# Altium project PCB_Project.PrjPcb
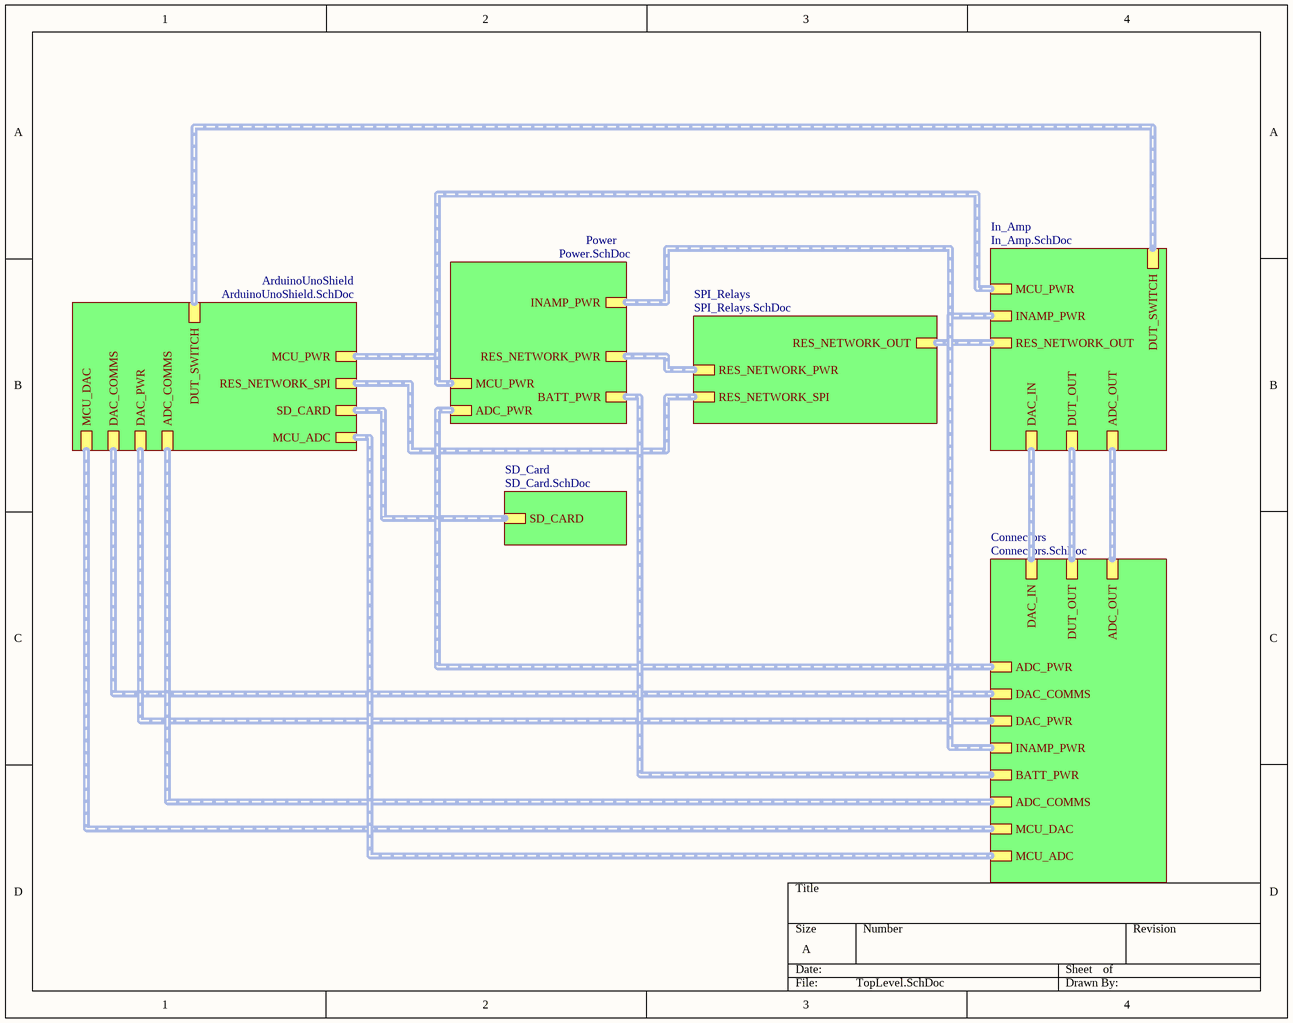
[diagram p0: TopLevel.SchDoc]
7 sheets, 123 parts. Net scope: hierarchical (ports join the sheet entries above them; power ports are global).
Board files: 6C-2L-1550um.PcbDoc, ArduinoUnoShield.PcbDoc
Sheets:
  TopLevel.SchDoc
    ArduinoUnoShield = ArduinoUnoShield.SchDoc
    Power = Power.SchDoc
    SD_Card = SD_Card.SchDoc
    In_Amp = In_Amp.SchDoc
    Connectors = Connectors.SchDoc
    SPI_Relays = SPI_Relays.SchDoc

## Sheet TopLevel.SchDoc
size A

### Sub-sheets
ArduinoUnoShield = ArduinoUnoShield.SchDoc: SD_CARD (harness SD_CARD), RES_NETWORK_SPI (harness RES_NETWORK_SPI), MCU_PWR (harness MCU_PWR), MCU_DAC (harness MCU_DAC), DAC_COMMS (harness DAC_COMMS), DAC_PWR (harness DAC_PWR), ADC_COMMS (harness ADC_COMMS), DUT_SWITCH (harness DUT_SWITCH), MCU_ADC (harness MCU_ADC)
Connectors = Connectors.SchDoc: DAC_IN (harness DAC_IN), DUT_OUT (harness DUT_OUT), ADC_OUT (harness ADC_OUT), ADC_PWR (harness ADC_PWR), DAC_COMMS (harness DAC_COMMS), DAC_PWR (harness DAC_PWR), INAMP_PWR (harness INAMP_PWR), BATT_PWR (harness BATT_PWR), ADC_COMMS (harness ADC_COMMS), MCU_DAC (harness MCU_DAC), MCU_ADC (harness MCU_ADC)
In_Amp = In_Amp.SchDoc: RES_NETWORK_OUT (harness RES_NETWORK_OUT), DAC_IN (harness DAC_IN), DUT_OUT (harness DUT_OUT), ADC_OUT (harness ADC_OUT), INAMP_PWR (harness INAMP_PWR), MCU_PWR (harness MCU_PWR), DUT_SWITCH (harness DUT_SWITCH)
Power = Power.SchDoc: RES_NETWORK_PWR (harness RES_NETWORK_PWR), MCU_PWR (harness MCU_PWR), ADC_PWR (harness ADC_PWR), INAMP_PWR (harness INAMP_PWR), BATT_PWR (harness BATT_PWR)
SD_Card = SD_Card.SchDoc: SD_CARD (harness SD_CARD)
SPI_Relays = SPI_Relays.SchDoc: RES_NETWORK_OUT (harness RES_NETWORK_OUT), RES_NETWORK_PWR (harness RES_NETWORK_PWR), RES_NETWORK_SPI (harness RES_NETWORK_SPI)

### Buses and harness runs
harness sheet ArduinoUnoShield/ADC_COMMS = sheet Connectors/ADC_COMMS
harness sheet ArduinoUnoShield/DAC_COMMS = sheet Connectors/DAC_COMMS
harness sheet ArduinoUnoShield/DAC_PWR = sheet Connectors/DAC_PWR
harness sheet ArduinoUnoShield/DUT_SWITCH = sheet In_Amp/DUT_SWITCH
harness sheet ArduinoUnoShield/MCU_ADC = sheet Connectors/MCU_ADC
harness sheet ArduinoUnoShield/MCU_DAC = sheet Connectors/MCU_DAC
harness sheet ArduinoUnoShield/MCU_PWR = sheet In_Amp/MCU_PWR = sheet Power/MCU_PWR
harness sheet ArduinoUnoShield/RES_NETWORK_SPI = sheet SPI_Relays/RES_NETWORK_SPI
harness sheet ArduinoUnoShield/SD_CARD = sheet SD_Card/SD_CARD
harness sheet Connectors/ADC_OUT = sheet In_Amp/ADC_OUT
harness sheet Connectors/ADC_PWR = sheet Power/ADC_PWR
harness sheet Connectors/BATT_PWR = sheet Power/BATT_PWR
harness sheet Connectors/DAC_IN = sheet In_Amp/DAC_IN
harness sheet Connectors/DUT_OUT = sheet In_Amp/DUT_OUT
harness sheet Connectors/INAMP_PWR = sheet In_Amp/INAMP_PWR = sheet Power/INAMP_PWR
harness sheet In_Amp/RES_NETWORK_OUT = sheet SPI_Relays/RES_NETWORK_OUT
harness sheet Power/RES_NETWORK_PWR = sheet SPI_Relays/RES_NETWORK_PWR

## Sheet ArduinoUnoShield.SchDoc
size A4
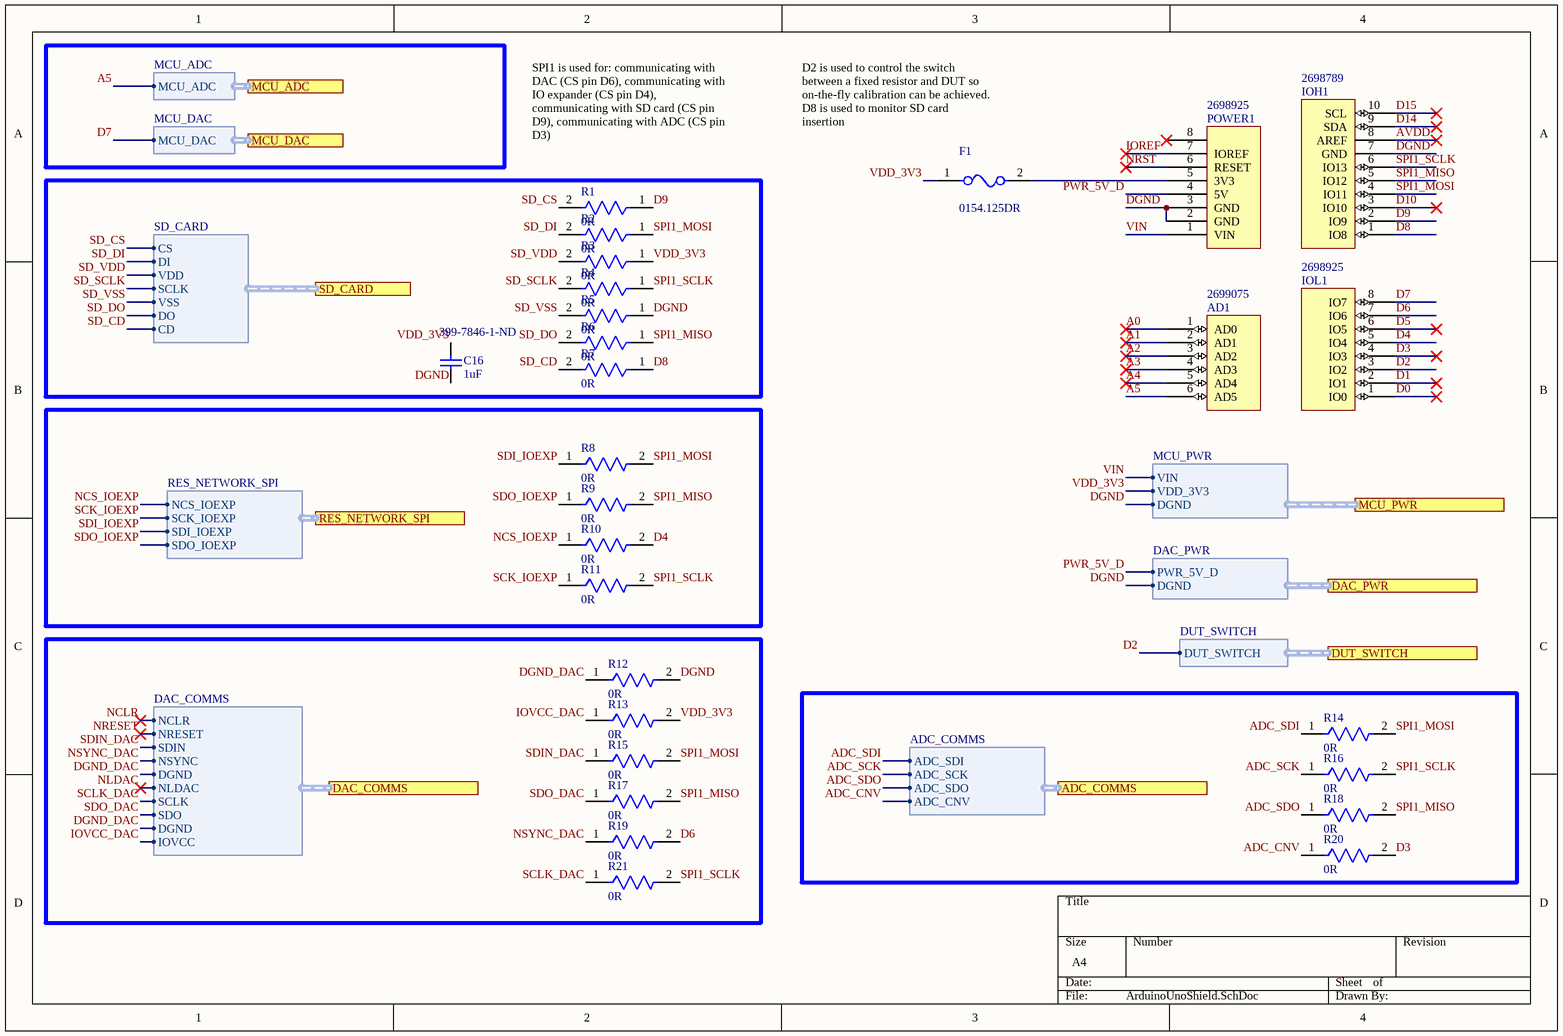
[diagram p1: ArduinoUnoShield.SchDoc]

### Parts
AD1  Supplier Part Number 4: 2699075  [Header 6x1 8.5mm]  (hidden comment: AD)
C16  1uF  Supplier Part Number 1: 399-7846-1-ND  [CAPC1608X95X35LL15T15]
F1  0154.125DR  [FP-0154-MFG]
IOH1  Supplier Part Number 3: 2698789  [Header 10x1 8.5mm]  (hidden comment: IOH)
IOL1  Supplier Part Number 4: 2698925  [Header 8x1 8.5mm]  (hidden comment: IOL)
POWER1  Supplier Part Number 4: 2698925  [Header 8x1 8.5mm]  (hidden comment: POWER_UNO)
R1  0R  [FP-CR0603-MFG]
R2  0R  [FP-CR0603-MFG]
R3  0R  [FP-CR0603-MFG]
R4  0R  [FP-CR0603-MFG]
R5  0R  [FP-CR0603-MFG]
R6  0R  [FP-CR0603-MFG]
R7  0R  [FP-CR0603-MFG]
R8  0R  [FP-CR0603-MFG]
R9  0R  [FP-CR0603-MFG]
R10  0R  [FP-CR0603-MFG]
R11  0R  [FP-CR0603-MFG]
R12  0R  [FP-CR0603-MFG]
R13  0R  [FP-CR0603-MFG]
R14  0R  [FP-CR0603-MFG]
R15  0R  [FP-CR0603-MFG]
R16  0R  [FP-CR0603-MFG]
R17  0R  [FP-CR0603-MFG]
R18  0R  [FP-CR0603-MFG]
R19  0R  [FP-CR0603-MFG]
R20  0R  [FP-CR0603-MFG]
R21  0R  [FP-CR0603-MFG]

### Ports
ADC_COMMS (harness ADC_COMMS), DAC_COMMS (harness DAC_COMMS), DAC_PWR (harness DAC_PWR), DUT_SWITCH (harness DUT_SWITCH), MCU_ADC (harness MCU_ADC), MCU_DAC (harness MCU_DAC), MCU_PWR (harness MCU_PWR), RES_NETWORK_SPI (harness RES_NETWORK_SPI), SD_CARD (harness SD_CARD)

### Harnesses
SD_CARD: CS, DI, VDD, SCLK, VSS, DO, CD
MCU_PWR: VDD_3V3, DGND, VIN
DAC_COMMS: NCLR, NRESET, SDIN, DGND, NSYNC, NLDAC, SDO, SCLK, DGND, IOVCC
RES_NETWORK_SPI: NCS_IOEXP, SCK_IOEXP, SDI_IOEXP, SDO_IOEXP
MCU_DAC: MCU_DAC
MCU_ADC: MCU_ADC
DAC_PWR: DGND, PWR_5V_D
ADC_COMMS: ADC_SCK, ADC_SDO, ADC_SDI, ADC_CNV
DUT_SWITCH: DUT_SWITCH

### Nets
A0: AD1.1(AD0)
A1: AD1.2(AD1)
A2: AD1.3(AD2)
A3: AD1.4(AD3)
A4: AD1.5(AD4)
A5: AD1.6(AD5) ; port MCU_ADC.MCU_ADC
ADC_CNV: R20.1 ; port ADC_COMMS.ADC_CNV
ADC_SCK: R16.1 ; port ADC_COMMS.ADC_SCK
ADC_SDI: R14.1 ; port ADC_COMMS.ADC_SDI
ADC_SDO: R18.1 ; port ADC_COMMS.ADC_SDO
AVDD: IOH1.8(AREF)
D0: IOL1.1(IO0)
D1: IOL1.2(IO1)
D2: IOL1.3(IO2) ; port DUT_SWITCH.DUT_SWITCH
D3: IOL1.4(IO3) R20.2
D4: IOL1.5(IO4) R10.2
D5: IOL1.6(IO5)
D6: IOL1.7(IO6) R19.2
D7: IOL1.8(IO7) ; port MCU_DAC.MCU_DAC
D8: IOH1.1(IO8) R7.1
D9: IOH1.2(IO9) R1.1
D10: IOH1.3(IO10)
D14: IOH1.9(SDA)
D15: IOH1.10(SCL)
DGND: C16.1 IOH1.7(GND) POWER1.2(GND) POWER1.3(GND) R5.1 R12.1 R12.2 ; port MCU_PWR.DGND, port DAC_COMMS.DGND, port DAC_PWR.DGND  [also labelled DGND_DAC]
IOREF: POWER1.7(IOREF)
IOVCC_DAC: R13.1 ; port DAC_COMMS.IOVCC  [project net IOVCC]
NCS_IOEXP: R10.1 ; port RES_NETWORK_SPI.NCS_IOEXP
NRST: POWER1.6(RESET)
NSYNC_DAC: R19.1 ; port DAC_COMMS.NSYNC  [project net NSYNC]
PWR_5V_D: POWER1.4(5V) ; port DAC_PWR.PWR_5V_D
SCK_IOEXP: R11.1 ; port RES_NETWORK_SPI.SCK_IOEXP
SCLK_DAC: R21.1 ; port DAC_COMMS.SCLK  [project net SCLK]
SD_CD: R7.2 ; port SD_CARD.CD
SD_CS: R1.2 ; port SD_CARD.CS
SD_DI: R2.2 ; port SD_CARD.DI
SD_DO: R6.2 ; port SD_CARD.DO
SD_SCLK: R4.2 ; port SD_CARD.SCLK
SD_VDD: R3.2 ; port SD_CARD.VDD
SD_VSS: R5.2 ; port SD_CARD.VSS
SDI_IOEXP: R8.1 ; port RES_NETWORK_SPI.SDI_IOEXP
SDIN_DAC: R15.1 ; port DAC_COMMS.SDIN  [project net SDIN]
SDO_DAC: R17.1 ; port DAC_COMMS.SDO  [project net SDO]
SDO_IOEXP: R9.1 ; port RES_NETWORK_SPI.SDO_IOEXP
SPI1_MISO: IOH1.5(IO12) R6.1 R9.2 R17.2 R18.2
SPI1_MOSI: IOH1.4(IO11) R2.1 R8.2 R14.2 R15.2
SPI1_SCLK: IOH1.6(IO13) R4.1 R11.2 R16.2 R21.2
VDD_3V3: C16.2 F1.1 R3.1 R13.2 ; port MCU_PWR.VDD_3V3
VIN: POWER1.1(VIN) ; port MCU_PWR.VIN  [project net PWR_VBAT]
NetF1_2: F1.2 POWER1.5(3V3)

Not connected (* = marked no-connect by the designer): POWER1 8*

### Notes on the sheet
- SPI1 is used for: communicating with DAC (CS pin D6), communicating with IO expander (CS pin D4), communicating with SD card (CS pin D9), communicating with ADC (CS pin D3)
- (near F1) D2 is used to control the switch between a fixed resistor and DUT so on-the-fly calibration can be achieved. D8 is used to monitor SD card insertion

### Library data of the parts
C16 = CMP-2006-02216-1: Manufacturer: Kemet; Part Number: C0603C105K3PACTU; Description: KEMET - C0603C105K3PACTU - SMD Multilayer Ceramic Capacitor, 1 µF, 25 V, 0603 [1608 Metric], ± 10%, X5R, C Series KEMET; Dielectric Material: Ceramic; Tolerance: 10%; Dielectric: X5R; Voltage Rating (DC): 25V; Supplier 1: Digi-Key; Manufacturer Part Number: C0603C105K3PACTU; RoHS: Yes; Category: Ceramic Capacitors; Stock 1: 157618; Pricing 1: 1=0.18000, 10=0.12700, 50=0.07220, 100=0.05980, 500=0.04194, 1000=0.03472 (USD); Mount: Surface Mount; Case/Package: 0603; Contact Plating: Tin,Matte; Min Operating Temperature: -55°C; Max Operating Temperature: 85°C; Capacitance: 1uF; Packaging: Tape and Reel; Voltage: 25V; Termination: SMD/SMT; Length: 1.6mm; Height: 0.8mm; Depth: 0.8mm; Radiation Hardening: No; Lead Free: Lead Free; ComponentLink1URL: https://datasheet.ciiva.com/28610/1918694-28610792.pdf?src-supplier=Element14; ComponentLink1Description: https://datasheet.ciiva.com/28610/1918694-28610792.pdf?src-supplier=Element14; ComponentLink2URL: https://datasheet.ciiva.com/5998/40889-5998745.pdf?src-supplier=Farnell; ComponentLink2Description: https://datasheet.ciiva.com/5998/40889-5998745.pdf?src-supplier=Farnell; Supplier Unit Price 1: 0.18
F1 = CMP-08604-000003-1: FUSE BOARD MNT 125MA 125VAC/VDC; Manufacturer: Littelfuse Inc; Voltage Rating Dc: 125V; Conn Orientation: Horizontal; Number Of Fuses: 1; Fuse Current: 0.125A; Automotive: No; Device Class L1: Circuit Protection; Temperature Range High: +125°C; Category: Fuse; Temperature: -55°C to +125°C; Lead Free: Yes; ComponentLink2Description: Datasheet; RoHS: TRUE; Mouser Description: Fuse Chip Very Fast Acting 0.125A SMD Solder Pad 9.73 X 5.03 X 3.81mm T/R CSA/PSE/UL; Octopart: https://octopart.com/0154.125dr-littelfuse-557957; Height: 3.81mm; Digikey Description: FUSE BOARD MNT 125MA 125VAC/VDC; Temperature Range Low: -55°C; Voltage Rating Ac: 125V; Device Class L3: unset; Package: 0154; Device Class L2: Fuse Holders; Manufacturer Part Number: 0154.125DR; ComponentLink2URL: https://www.littelfuse.com/~/media/electronics/datasheets/fuses/littelfuse_fuse_154_154t_154l_154tl_datasheet.pdf.pdf
R1-R21 = CMP-07231-000023-1: Thick Film Chip Resistors 0603 0Ω 0.1W 5%; Power Rating: 100mW; Resistance: 0mR; Voltage Rating (DC): 50V; Tolerance: 1%; Temperature Coefficient: 500ppm/°C; Depth: 0.8mm; Height: 0.45mm; Case Code (Metric): 1608; Number of Pins: 2; Max Operating Temperature: 155°C; Mount: Surface Mount; REACH SVHC: No SVHC; Radiation Hardening: No; Width: 0.8mm; Max Power Dissipation: 100mW; Thickness: 457um; Package Quantity: 5000; Composition: Thick Film; Case/Package: 0603; Military Standard: Not; Packaging: Tape and Reel; Voltage Rating: 50V; Case Code (Imperial): 0603; Min Operating Temperature: -55°C; Contact Plating: Tin; Length: 1.6mm; Termination: SMD/SMT
AD1 = AD: Supplier 1: Arrow; Supplier Part Number 1: 2699089; Supplier 2: Digi-Key; Supplier Part Number 2: SAM1198-06-ND; Supplier 3: Arrow; Supplier Part Number 3: 2699088; Supplier 4: Arrow
IOH1 = IOH: Supplier 1: Arrow; Supplier Part Number 1: 2698803S4475693N1004; Supplier 2: Digi-Key; Supplier Part Number 2: SAM1198-10-ND; Supplier 3: Arrow
IOL1 = IOL: Supplier 1: Digi-Key; Supplier Part Number 1: SAM1198-08-ND; Supplier 2: Arrow; Supplier Part Number 2: 2698939; Supplier 3: Arrow; Supplier Part Number 3: 2698940; Supplier 4: Arrow
POWER1 = POWER_UNO: Supplier 1: Digi-Key; Supplier Part Number 1: SAM1198-08-ND; Supplier 2: Arrow; Supplier Part Number 2: 2698939; Supplier 3: Arrow; Supplier Part Number 3: 2698940; Supplier 4: Arrow

## Sheet Power.SchDoc
size A
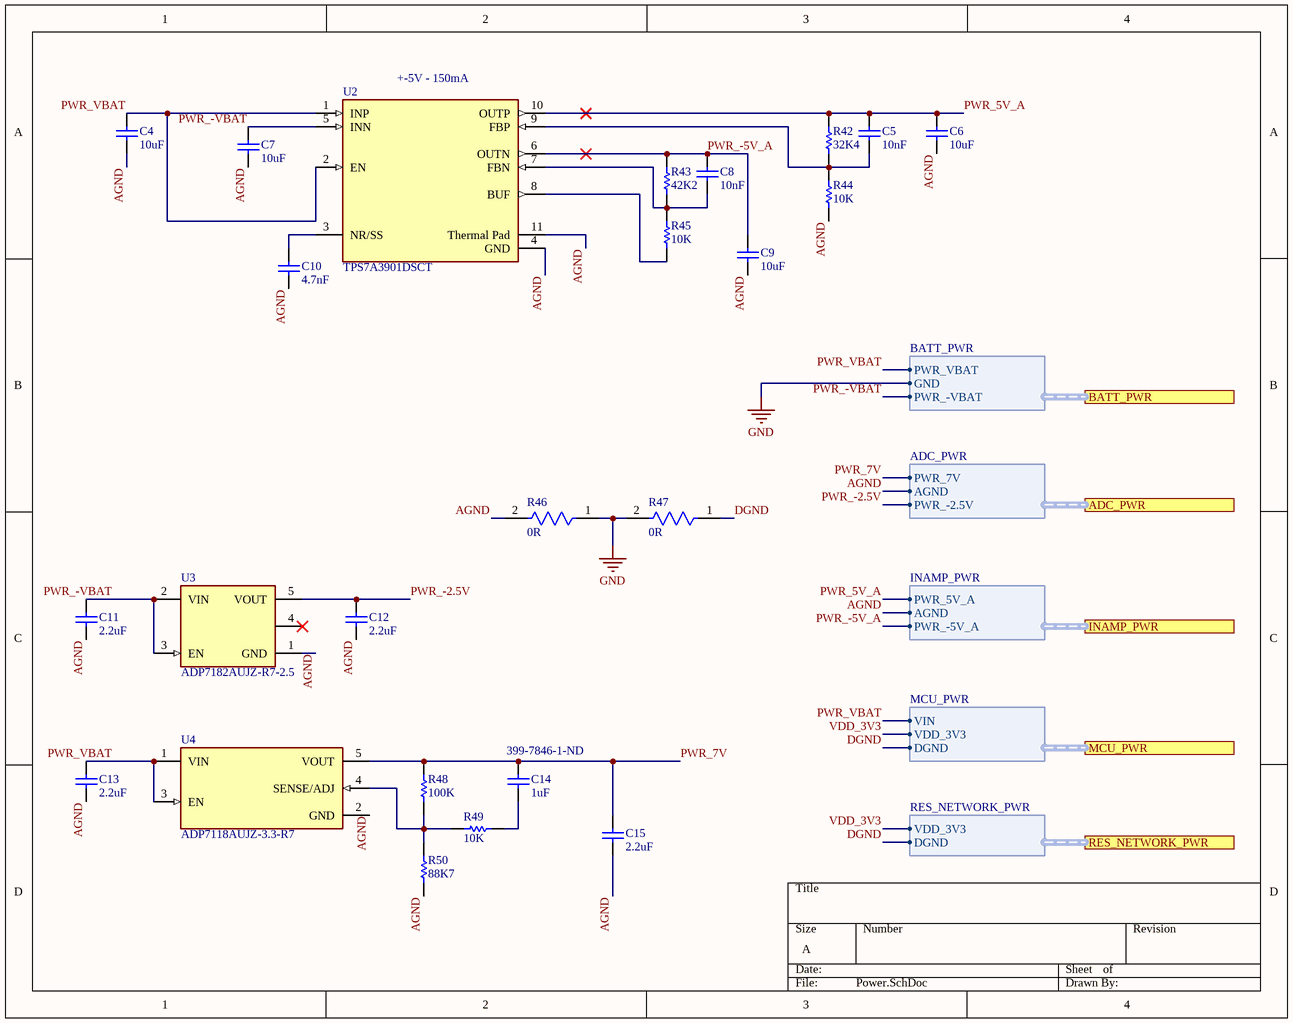
[diagram p2: Power.SchDoc]

### Parts
C4  10uF  [CAPC2013X135X45ML10T25]
C5  10nF  [CAPC1608X90X35LL15T15]
C6  10uF  [CAPC2013X135X45ML10T25]
C7  10uF  [CAPC2013X135X45ML10T25]
C8  10nF  [CAPC1608X90X35LL15T15]
C9  10uF  [CAPC2013X135X45ML10T25]
C10  4.7nF  [CAPC1608X90X35LL15T15]
C11  2.2uF  [CAPC1608X90X35ML10T15]
C12  2.2uF  [CAPC1608X90X35ML10T15]
C13  2.2uF  [CAPC1608X90X35ML10T15]
C14  1uF  Supplier Part Number 1: 399-7846-1-ND  [CAPC1608X95X35LL15T15]
C15  2.2uF  [CAPC1608X90X35ML10T15]
R42  32K4  [RESC1608X55X25ML10T15]
R43  42K2  [RESC0805(2012)_N]
R44  10K  [RESC1609X50X30NL8T20]
R45  10K  [RESC1609X50X30NL8T20]
R46  0R  [FP-CR0603-MFG]
R47  0R  [FP-CR0603-MFG]
R48  100K  [RESC1608X55X25ML10T15]
R49  10K  [RESC1609X50X30NL8T20]
R50  88K7  [RESC1608X55X25ML10T15]
U2  TPS7A3901DSCT  [TPS7A3901DSCT]
U3  ADP7182AUJZ-R7-2.5  [FP-UJ-5-IPC_A]
U4  ADP7118AUJZ-3.3-R7  [FP-UJ-5-IPC_C]

### Ports
ADC_PWR (harness ADC_PWR), BATT_PWR (harness BATT_PWR), INAMP_PWR (harness INAMP_PWR), MCU_PWR (harness MCU_PWR), RES_NETWORK_PWR (harness RES_NETWORK_PWR)

### Harnesses
RES_NETWORK_PWR: VDD_3V3, DGND
MCU_PWR: VDD_3V3, DGND, VIN
INAMP_PWR: AGND, PWR_-5V_A, PWR_5V_A
ADC_PWR: AGND, PWR_-2.5V, PWR_7V
BATT_PWR: GND, PWR_-VBAT, PWR_VBAT

### Nets
GND: R46.1 R47.2 ; port BATT_PWR.GND
AGND: C4.1 C6.1 C7.1 C9.1 C10.1 C11.1 C12.1 C13.1 C15.1 R44.1 R46.2 R50.1 U2.4(GND) U2.11(Thermal_Pad) U3.1(GND) U4.2(GND) ; port INAMP_PWR.AGND, port ADC_PWR.AGND
DGND: R47.1 ; port RES_NETWORK_PWR.DGND, port MCU_PWR.DGND
PWR_5V_A: C5.2 C6.2 R42.1 U2.10(OUTP) ; port INAMP_PWR.PWR_5V_A
PWR_7V: C14.2 C15.2 R48.2 U4.5(VOUT) ; port ADC_PWR.PWR_7V
PWR_-2.5V: C12.2 U3.5(VOUT) ; port ADC_PWR.PWR_-2.5V
PWR_-5V_A: C8.2 C9.2 R43.2 U2.6(OUTN) ; port INAMP_PWR.PWR_-5V_A
PWR_-VBAT: C7.2 C11.2 U2.5(INN) U3.2(VIN) U3.3(EN) ; port BATT_PWR.PWR_-VBAT
PWR_VBAT: C4.2 C13.2 U2.1(INP) U2.2(EN) U4.1(VIN) U4.3(EN) ; port MCU_PWR.VIN, port BATT_PWR.PWR_VBAT
VDD_3V3: port RES_NETWORK_PWR.VDD_3V3, port MCU_PWR.VDD_3V3
NetC5_1: C5.1 R42.2 R44.2 U2.9(FBP)
NetC8_1: C8.1 R43.1 R45.2 U2.7(FBN)
NetC10_2: C10.2 U2.3(NR/SS)
NetC14_1: C14.1 R49.2
NetR45_1: R45.1 U2.8(BUF)
NetR48_1: R48.1 R49.1 R50.2 U4.4(SENSE/ADJ)

Not connected (* = marked no-connect by the designer): U3 4(ADJ)*

### Notes on the sheet
- (near U2) +-5V - 150mA

### Library data of the parts
C4 C6 C7 C9 = CMP-2007-03541-1: Part Number: GRM21BR61E106KA73L; Manufacturer: Murata
C5 C8 = CMP-2006-04374-1: Manufacturer: AVX Interconnect / Elco; Part Number: 06035C-103KAT2A
C10 = CMP-2006-04439-1: Part Number: 06035C472KAT2A; Manufacturer: AVX Interconnect / Elco
C11-C13 C15 = CMP-2006-02820-1: Part Number: GRM188R61E225KA12D; Manufacturer: Murata
C14 = CMP-2006-02216-1: as C16 on sheet ArduinoUnoShield; Supplier 1: Digi-Key; Manufacturer Part Number: C0603C105K3PACTU; RoHS: Yes; Category: Ceramic Capacitors; Stock 1: 157618; Pricing 1: 1=0.18000, 10=0.12700, 50=0.07220, 100=0.05980, 500=0.04194, 1000=0.03472 (USD); Mount: Surface Mount; Case/Package: 0603; Contact Plating: Tin,Matte; Min Operating Temperature: -55°C; Max Operating Temperature: 85°C; Capacitance: 1uF; Packaging: Tape and Reel; Voltage: 25V; Termination: SMD/SMT; Length: 1.6mm; Height: 0.8mm; Depth: 0.8mm; Radiation Hardening: No; Lead Free: Lead Free; ComponentLink1URL: https://datasheet.ciiva.com/28610/1918694-28610792.pdf?src-supplier=Element14; ComponentLink1Description: https://datasheet.ciiva.com/28610/1918694-28610792.pdf?src-supplier=Element14; ComponentLink2URL: https://datasheet.ciiva.com/5998/40889-5998745.pdf?src-supplier=Farnell; ComponentLink2Description: https://datasheet.ciiva.com/5998/40889-5998745.pdf?src-supplier=Farnell; Supplier Unit Price 1: 0.18
R42 = CMP-2000-04011-1: Manufacturer: Yageo; Part Number: RC0603FR-0732K4L
R43 = CMP-1013-00693-1: 42K2 0.125W 1% 0805 (2012 Metric)  SMD; Case-EIA: 0805; Value: 42200.00 Ohm; Case-Metric: 2012; Power: 0.125 W; Tolerance: 1 %; Technology: SMT
R44 R45 R49 = CMP-1666-00005-4: Chip Resistor, 10 KOhm, +/- 1%, 100 mW, -55 to 155 degC, 0603 (1608 Metric), RoHS, Tape and Reel; Manufacturer: Vishay Semiconductor; Voltage Rating: 75 V; Max Operating Temperature: 155 degC; PackageDescription: 2-Pin Surface Mount Device, Body 1.575 x 0.85 mm; ComponentLink1Description: Manufacturer URL; RoHSCompliant: true; PackageReference: 0603; REACH SVHC: Unknown; Length: 1.55 mm; DatasheetVersion: 06/2012; Packaging: Tape and Reel; Min Operating Temperature: -55 degC; Mounting Technology: Surface Mount; ComponentLink2URL: https://datasheet.ciiva.com/11809/0900766b80d98afc-11809037.pdf; Height: 0.45 mm; ComponentLink2Description: Datasheet; Package Quantity: 5000; ComponentLink1URL: http://www.vishay.com/
R46 R47 = CMP-07231-000023-1: as R1 on sheet ArduinoUnoShield; Depth: 0.8mm; Height: 0.45mm; Case Code (Metric): 1608; Number of Pins: 2; Max Operating Temperature: 155°C; Mount: Surface Mount; REACH SVHC: No SVHC; Radiation Hardening: No; Width: 0.8mm; Max Power Dissipation: 100mW; Thickness: 457um; Package Quantity: 5000; Composition: Thick Film; Case/Package: 0603; Military Standard: Not; Packaging: Tape and Reel; Voltage Rating: 50V; Case Code (Imperial): 0603; Min Operating Temperature: -55°C; Contact Plating: Tin; Length: 1.6mm; Termination: SMD/SMT
R48 = CMP-2100-03662-1: Chip Resistor, 100 KOhm, +/- 1%, 0.1 W, -55 to 155 degC, 0603 (1608 Metric), RoHS, Tape and Reel; Manufacturer: Yageo; Power Rating: 100mW; Voltage Rating: 50V; Temperature Coefficient: 100ppm/degreesC; Datasheet Version: Rev. 5, 10/2016; Height: 0.45mm; Lead Free: LeadFree; Manufacturer URL: http://www.yageo.com/; Package Reference: 0603; Depth: 0.8mm; RoHSCompliant: true; Composition: ThickFilm; Military Standard: Not; Resistance: 100KOhm; Case/Package: 0603; Packaging: TapeandReel; Case Code (Imperial): 0603; Voltage Rating (DC): 50V; Case Code (Metric): 1608; Tolerance: 1%; Termination: SMD/SMT; Min Operating Temperature: -55degC; Number of Pins: 2; Length: 1.6mm; Width: 0.8mm; Datasheet URL: http://www.yageo.com/NewPortal/yageodocoutput?fileName=/pdf/R-Chip/PYu-RC_Group_51_RoHS_L_5.pdf; Package Description: 2-Pin Surface Mount Device, Body 1.6 x 0.8 mm; Max Operating Temperature: 155degC; REACH SVHC: NoSVHC
R50 = CMP-2000-04152-1: Manufacturer: Yageo; Part Number: RC0603FR-0788K7L
U2 = TPS7A3901DSCT: Manufacturer 1: Texas Instruments; Supplier 1: Digi-Key; Supplier Part Number 1: 296-47504-1-ND; Manufacturer Part Number 1: TPS7A3901DSCT
U3 = CMP-09138-000013-1: IC REG LIN NEG ADJ 200MA 5TSOT; Manufacturer: Analog Devices; Number Of Outputs: 1; Min Supply Voltage: -2.7V; Max Junction Temp: +125°C; Dropout Voltage: -185mV; Output Current: -200mA; Max Supply Voltage: -28V; Output Voltage: -1.22/-27.815V; Nominal Supply Current: -33/-650uA; Output Type: AdjustableProgrammable; Accuracy Percentage: 1%; RoHS: TRUE; Ambient Temperature Range Low: -40°C; Digikey Description: IC REG LIN NEG ADJ 200MA 5TSOT; Device Class L3: Voltage Regulators - Linear; Ambient Temperature Range High: +85°C; Manufacturer Part Number: ADP7182AUJZ-R7; ComponentLink2URL: https://www.analog.com/media/en/technical-documentation/data-sheets/ADP7182.pdf; Ipc Land Pattern Name: SOT95P280X100-5; Temperature Range Low: -40°C; ComponentLink2Description: Datasheet; Mouser Description: LDO Regulator Neg -1.22V to -27V 0.2A 5-Pin TSOT T/R; Category: IC; Automotive: No; Device Class L1: Integrated Circuits (ICs); Temperature: -40°C to +125°C; Octopart: https://octopart.com/adp7182aujz-r7-analog+devices-21054665; Device Class L2: Power Management ICs; Height: 1mm; Package: UJ-5; Temperature Range High: +125°C; Lead Free: Yes
U4 = CMP-09138-000020-1: IC REG LIN 3.3V 200MA TSOT23-5; Dropout Voltage: 200mV; Number of Regulators: 1; Max Input Voltage: 20V; Output Type: Fixed; Min Input Voltage: 2.7V; Quiescent Current: 140uA; Polarity: Positive; Min Current Limit: 250mA; Accuracy: 0.8%; Max Operating Temperature: 125°C; Min Operating Temperature: -40°C; Number of Outputs: 1; Contact Plating: Tin; Output Current: 200mA; Lead Free: Contains Lead; Output Voltage: 3.3V; Number of Pins: 5; Mount: Surface Mount; Case/Package: SOT-23-5; Max Output Current: 200mA; Packaging: Tape and Reel

## Sheet SD_Card.SchDoc
size A
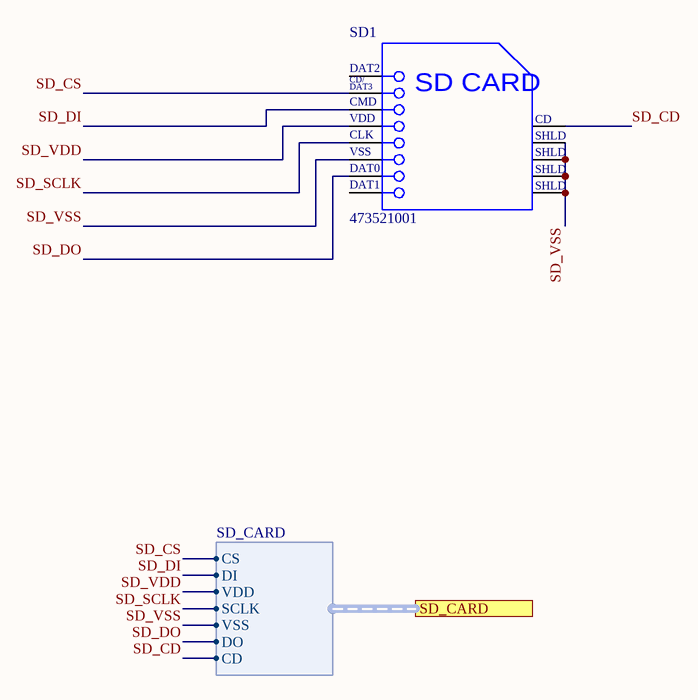
[diagram p3: SD_Card.SchDoc]

### Parts
SD1  473521001  [MOLX-473521001_V]

### Ports
SD_CARD (harness SD_CARD)

### Harnesses
SD_CARD: CS, DI, VDD, SCLK, VSS, DO, CD

### Nets
SD_CD: SD1.9(CD) ; port SD_CARD.CD
SD_CS: SD1.2(CD/DAT3) ; port SD_CARD.CS
SD_DI: SD1.3(CMD) ; port SD_CARD.DI
SD_DO: SD1.7(DAT0) ; port SD_CARD.DO
SD_SCLK: SD1.5(CLK) ; port SD_CARD.SCLK
SD_VDD: SD1.4(VDD) ; port SD_CARD.VDD
SD_VSS: SD1.6(VSS) SD1.10(SHLD) SD1.11(SHLD) SD1.12(SHLD) SD1.13(SHLD) ; port SD_CARD.VSS

Not connected (* = marked no-connect by the designer): SD1 1(DAT2) 8(DAT1)

### Notes on the sheet
- (in symbol CMP-2000-05848-1) CD/; DAT3; SD CARD

### Library data of the parts
SD1 = CMP-2000-05848-1: MicroSD(TM), Pitch 1.1 mm, 8 Position, Height 1.88 mm, -20 to 85 degC, RoHS, Tape and Reel; Manufacturer: Molex; Datasheet Version: Rev. G, 01/2012; Datasheet URL: http://www.molex.com/pdm_docs/sd/473521001_sd.pdf; Package Reference: 473521001; Manufacturer URL: http://www.molex.com/; Mounting Technology: SurfaceMount; Package Description: MicroSD(TM), Pitch 1.1 mm, 8 Position, Height 1.88 mm; Supplier Unit Price 1: 3.58000; Supplier 1: Digi-Key; Supplier Part Number 1: WM3290CT-ND

## Sheet In_Amp.SchDoc
size A
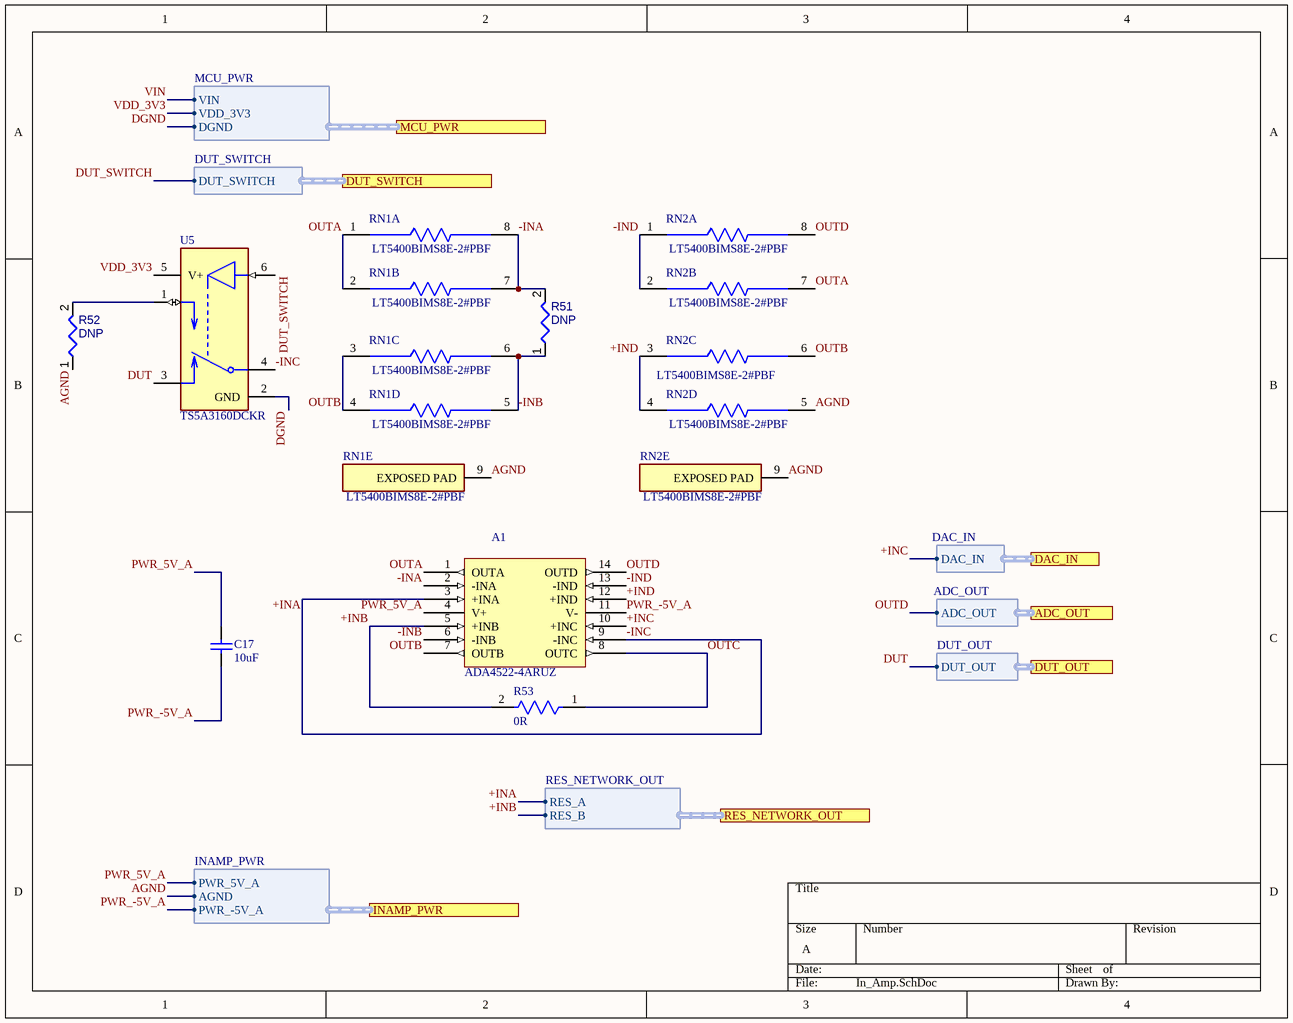
[diagram p4: In_Amp.SchDoc]

### Parts
A1  ADA4522-4ARUZ  [TSSOP14]
C17  10uF  [CAPC2013X135X45ML10T25]
R51  DNP  [RESC1608X55X25ML10T15]
R52  DNP  [RESC1608X55X25ML10T15]
R53  0R  [FP-CR0603-MFG]
RN1  LT5400BIMS8E-2#PBF  [FP-MS8E-8-05-08-1662-MFG]  (parts A,B,C,D,E of 5)
RN2  LT5400BIMS8E-2#PBF  [FP-MS8E-8-05-08-1662-MFG]  (parts A,B,C,D,E of 5)
U5  TS5A3160DCKR  [FP-DCK0006A-MFG]

### Ports
ADC_OUT (harness ADC_OUT), DAC_IN (harness DAC_IN), DUT_OUT (harness DUT_OUT), DUT_SWITCH (harness DUT_SWITCH), INAMP_PWR (harness INAMP_PWR), MCU_PWR (harness MCU_PWR), RES_NETWORK_OUT (harness RES_NETWORK_OUT)

### Harnesses
RES_NETWORK_OUT: RES_A, RES_B
DUT_OUT: DUT_OUT
INAMP_PWR: AGND, PWR_-5V_A, PWR_5V_A
MCU_PWR: VDD_3V3, DGND, VIN
DUT_SWITCH: DUT_SWITCH
DAC_IN: DAC_IN
ADC_OUT: ADC_OUT

### Nets
+INA: A1.3(+INA) A1.9(-INC) U5.4(COM) ; port RES_NETWORK_OUT.RES_A  [also labelled -INC]
+INB: A1.5(+INB) R53.2 ; port RES_NETWORK_OUT.RES_B
+INC: A1.10(+INC) ; port DAC_IN.DAC_IN
+IND: A1.12(+IND) RN2.3(1_R3) RN2.4(1_R4)
-INA: A1.2(-INA) R51.2 RN1.7(2_R2) RN1.8(2_R1)
-INB: A1.6(-INB) R51.1 RN1.5(2_R4) RN1.6(2_R3)
-IND: A1.13(-IND) RN2.1(1_R1) RN2.2(1_R2)
AGND: R52.1 RN1.9(EXPOSED_PAD) RN2.5(2_R4) RN2.9(EXPOSED_PAD) ; port INAMP_PWR.AGND
DGND: U5.2(GND) ; port MCU_PWR.DGND
DUT: U5.3(NC) ; port DUT_OUT.DUT_OUT
DUT_SWITCH: U5.6(IN) ; port DUT_SWITCH.DUT_SWITCH  [project net D2]
OUTA: A1.1(OUTA) RN1.1(1_R1) RN1.2(1_R2) RN2.7(2_R2)
OUTB: A1.7(OUTB) RN1.3(1_R3) RN1.4(1_R4) RN2.6(2_R3)
OUTC: A1.8(OUTC) R53.1
OUTD: A1.14(OUTD) RN2.8(2_R1) ; port ADC_OUT.ADC_OUT
PWR_5V_A: A1.4(V+) C17.2 ; port INAMP_PWR.PWR_5V_A
PWR_-5V_A: A1.11(V-) C17.1 ; port INAMP_PWR.PWR_-5V_A
VDD_3V3: U5.5(V+) ; port MCU_PWR.VDD_3V3
NetR52_2: R52.2 U5.1(NO)

### Library data of the parts
A1 = AD4522-4ARUZ: Manufacturer 1: Analog Devices; Manufacturer Part Number 1: ADA4522-4ARUZ-R7; Supplier 1: Digi-Key; Supplier Part Number 1: ADA4522-4ARUZ-R7CT-ND; Supplier Unit Price 1: 8.45000
C17 = CMP-2007-03541-1: as C4 on sheet Power
R51 R52 = CMP-009-00023-4: do not place
R53 = CMP-07231-000023-1: as R1 on sheet ArduinoUnoShield; Depth: 0.8mm; Height: 0.45mm; Case Code (Metric): 1608; Number of Pins: 2; Max Operating Temperature: 155°C; Mount: Surface Mount; REACH SVHC: No SVHC; Radiation Hardening: No; Width: 0.8mm; Max Power Dissipation: 100mW; Thickness: 457um; Package Quantity: 5000; Composition: Thick Film; Case/Package: 0603; Military Standard: Not; Packaging: Tape and Reel; Voltage Rating: 50V; Case Code (Imperial): 0603; Min Operating Temperature: -55°C; Contact Plating: Tin; Length: 1.6mm; Termination: SMD/SMT
RN1 RN2 = CMP-09039-000001-1: RES ARRAY 4 RES 1K OHM 8TSSOP; Manufacturer: Analog Devices; Standoff Height: 0.0508mm; Power Per Resistor: 800mW; Number Of Resistors: 4; Resistance: 1kΩ; Voltage Rating: 75V; Tolerance: 15%; Value: 100K; Temperature Coefficient: 8ppm/°C; Height: 1.1mm; Octopart: https://octopart.com/lt5400ahms8e-4%23pbf-analog+devices-88940367; Package: MS8E-8-05-08-1662; ComponentLink2URL: https://www.analog.com/media/en/technical-documentation/data-sheets/5400fc.pdf; Automotive: No; Temperature Range Low: -40°C; Digikey Description: RES ARRAY 4 RES 1K OHM 8TSSOP; Lead Free: Yes; Ipc Land Pattern Name: SOP65P490X110-8; Device Class L1: Passive Components; Category: Res; ComponentLink2Description: Datasheet; RoHS: TRUE; Device Class L2: Resistors; Device Class L3: Resistor Arrays; Termination: Gull-Wing; Series: LT5400; Manufacturer Part Number: LT5400BIMS8E-2#PBF; Temperature Range High: +125°C; Temperature: -40°C to +125°C
U5 = CMP-04892-000008-1: IC SWITCH SPDT SC70-6; Manufacturer: Texas Instruments; Nominal Supply Current: 0.01uA; On State Resistance: 0.7Ω; Standoff Height: 0mm; Number Of Circuits: 1; Min Supply Voltage: 1.65V; Max Supply Voltage: 5.5V; Package: DCK0006A; Ambient Temperature Range Low: -40°C; Temperature Range High: +85°C; Category: IC; RoHS: TRUE; Octopart: https://octopart.com/ts5a3160dckr-texas+instruments-665387; Ambient Temperature Range High: +85°C; Automotive: No; Manufacturer Part Number: TS5A3160DCKR; ComponentLink2Description: Datasheet; Height: 1.1mm; Device Class L3: Analog Switches; Temperature Range Low: -40°C; ComponentLink2URL: http://www.ti.com/lit/ds/symlink/ts5a3160.pdf; Device Class L2: Interface ICs; Temperature: -40°C to +85°C; Lead Free: Yes; Throw Configuration: SPDT; Mouser Description: 1-Ohm SPDT Analog Switch 5-V/3.3-V Single-Channel 2: 1 Multiplexer/Demultiplexer 6-SC70 -40 to 85; Digikey Description: IC SWITCH SPDT SC70-6; Device Class L1: Integrated Circuits (ICs)

## Sheet Connectors.SchDoc
size A3
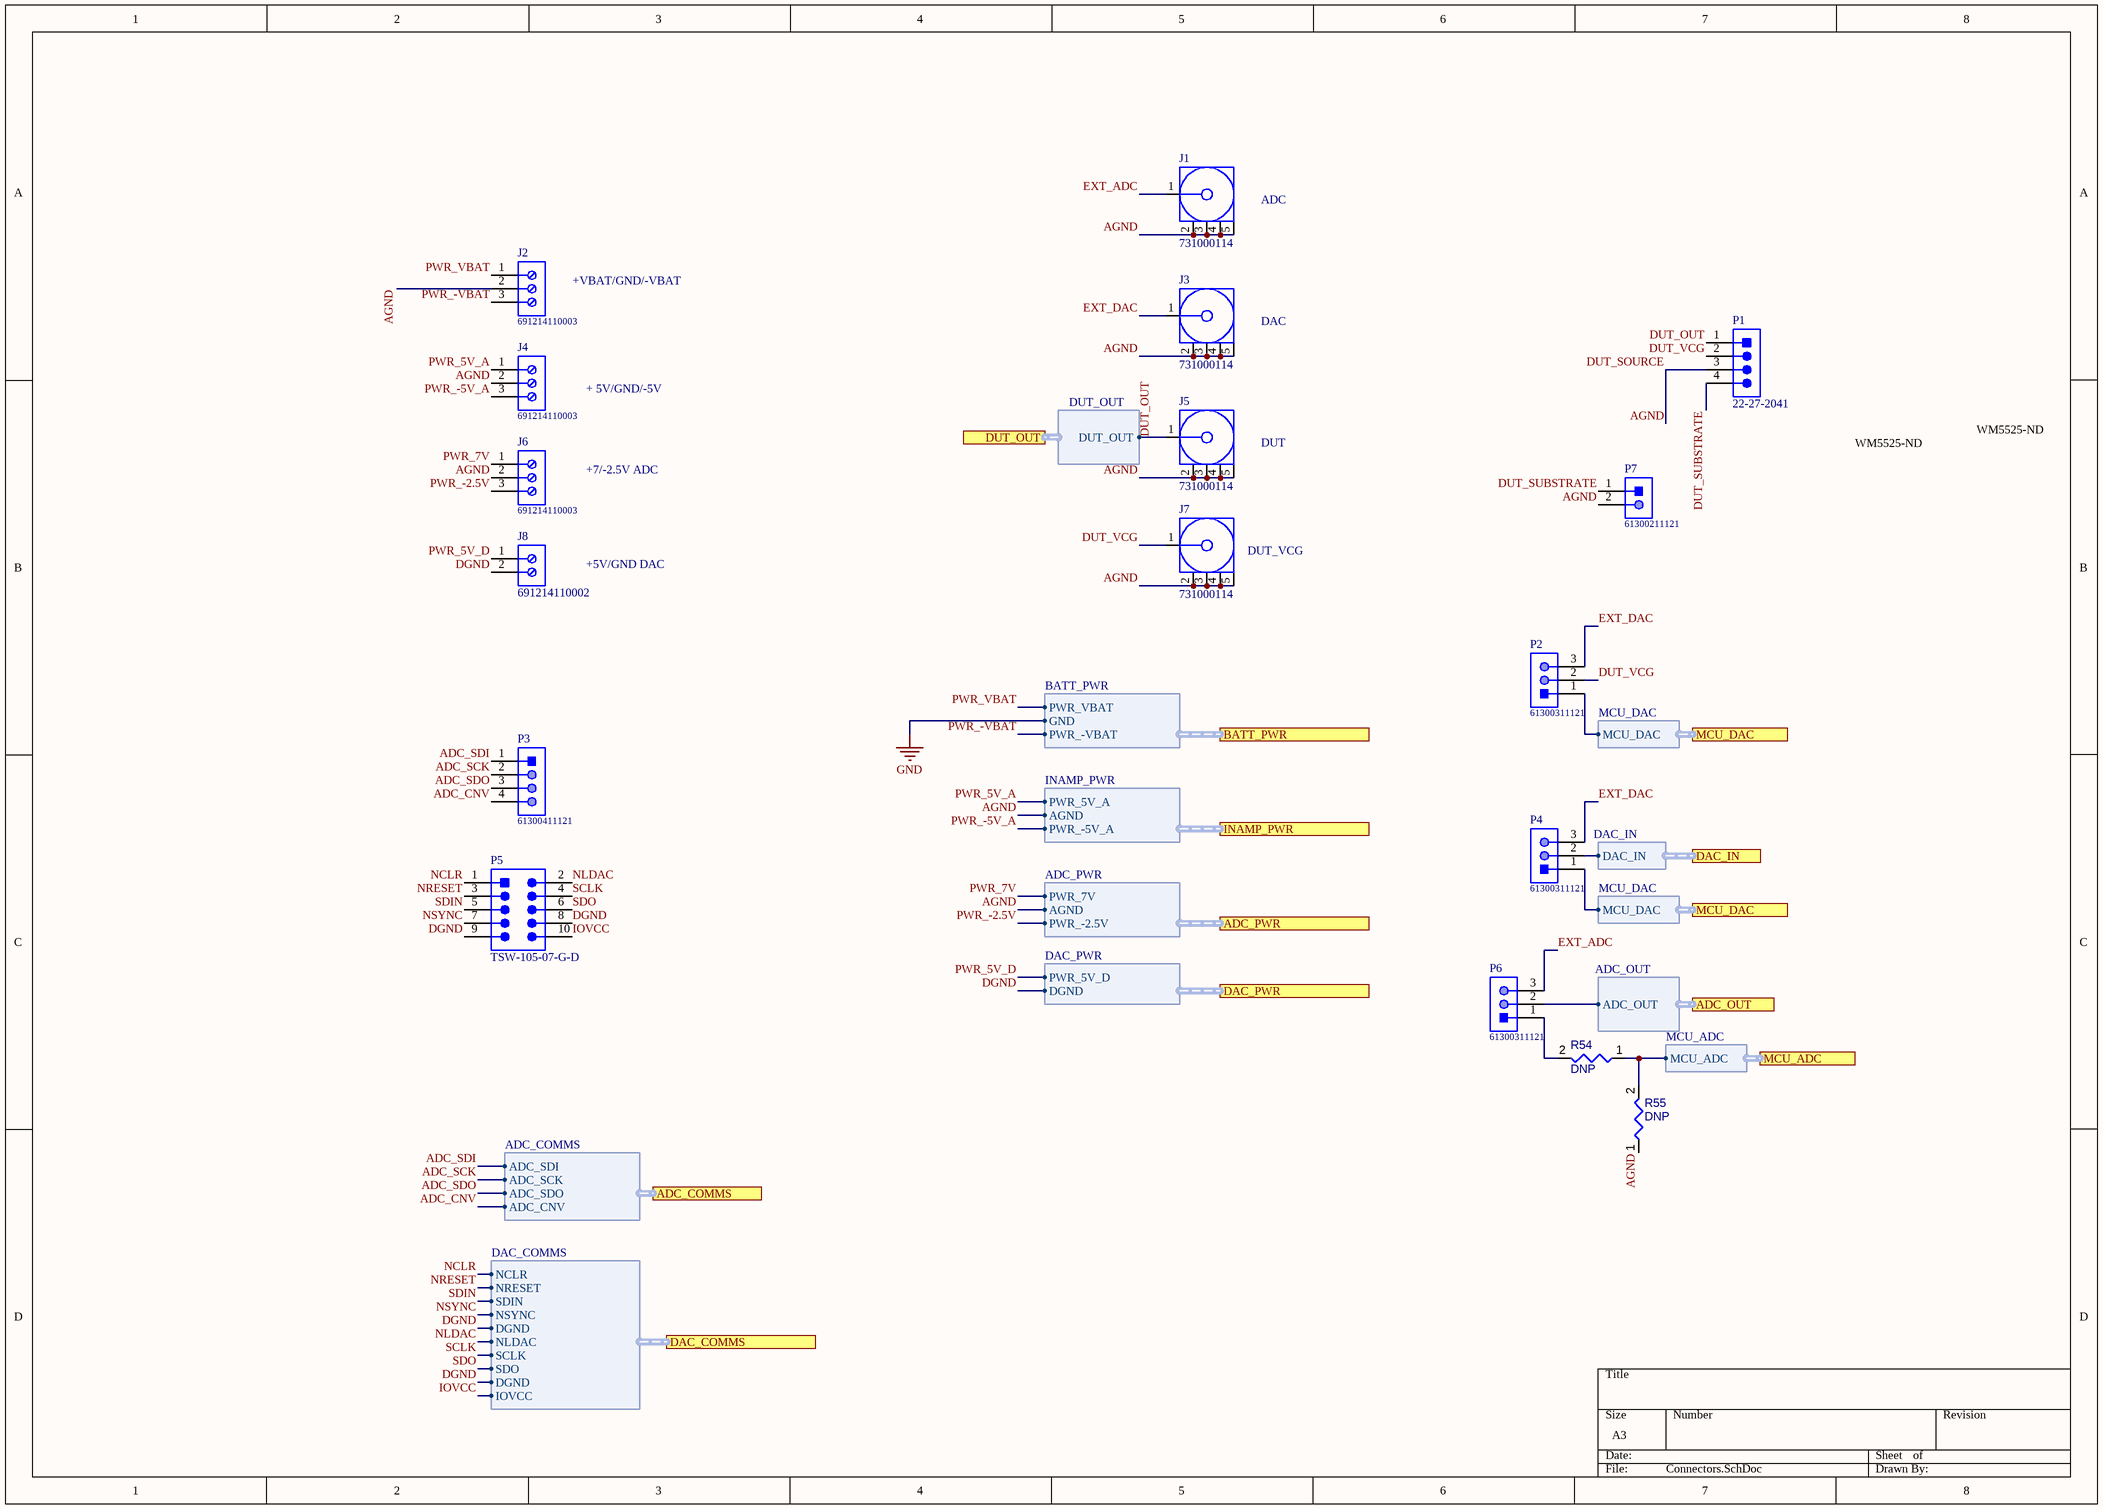
[diagram p5: Connectors.SchDoc]

### Parts
J1  731000114  [MOLX-731000114_V]
J2  691214110003  [691214110003]
J3  731000114  [MOLX-731000114_V]
J4  691214110003  [691214110003]
J5  731000114  [MOLX-731000114_V]
J6  691214110003  [691214110003]
J7  731000114  [MOLX-731000114_V]
J8  691214110002  [691214110002]
P1  22-27-2041  [MOLX-22-27-2041_V]
P2  61300311121  [61300311121]
P3  61300411121  [61300411121]
P4  61300311121  [61300311121]
P5  TSW-105-07-G-D  [SMTC-TSW-105-07-G-D_V]
P6  61300311121  [61300311121]
P7  61300211121  [61300211121]
R54  DNP  [RESC1608X55X25ML10T15]
R55  DNP  [RESC1608X55X25ML10T15]

### Ports
ADC_COMMS (harness ADC_COMMS), ADC_OUT (harness ADC_OUT), ADC_PWR (harness ADC_PWR), BATT_PWR (harness BATT_PWR), DAC_COMMS (harness DAC_COMMS), DAC_IN (harness DAC_IN), DAC_PWR (harness DAC_PWR), DUT_OUT (harness DUT_OUT), INAMP_PWR (harness INAMP_PWR), MCU_ADC (harness MCU_ADC), MCU_DAC (harness MCU_DAC)

### Harnesses
DUT_OUT: DUT_OUT
ADC_PWR: AGND, PWR_-2.5V, PWR_7V
DAC_COMMS: NCLR, NRESET, SDIN, DGND, NSYNC, NLDAC, SDO, SCLK, DGND, IOVCC
DAC_PWR: DGND, PWR_5V_D
INAMP_PWR: AGND, PWR_-5V_A, PWR_5V_A
BATT_PWR: GND, PWR_-VBAT, PWR_VBAT
ADC_COMMS: ADC_SCK, ADC_SDO, ADC_SDI, ADC_CNV
MCU_DAC: MCU_DAC
DAC_IN: DAC_IN
MCU_ADC: MCU_ADC
ADC_OUT: ADC_OUT

### Nets
+INC: P4.2 ; port DAC_IN.DAC_IN
A5: R54.1 R55.2 ; port MCU_ADC.MCU_ADC
ADC_CNV: P3.4 ; port ADC_COMMS.ADC_CNV
ADC_SCK: P3.2 ; port ADC_COMMS.ADC_SCK
ADC_SDI: P3.1 ; port ADC_COMMS.ADC_SDI
ADC_SDO: P3.3 ; port ADC_COMMS.ADC_SDO
AGND: J1.2 J1.3 J1.4 J1.5 J2.2 J3.2 J3.3 J3.4 J3.5 J4.2 J5.2 J5.3 J5.4 J5.5 J6.2 J7.2 J7.3 J7.4 J7.5 P1.3 P7.2 R55.1 ; port ADC_PWR.AGND, port INAMP_PWR.AGND  [also labelled DUT_SOURCE]
D7: P2.1 P4.1 ; port MCU_DAC.MCU_DAC
DGND: J8.2 P5.8 P5.9 ; port DAC_COMMS.DGND, port DAC_PWR.DGND
DUT_OUT: J5.1 P1.1 ; port DUT_OUT.DUT_OUT  [project net DUT]
DUT_SUBSTRATE: P1.4 P7.1
DUT_VCG: J7.1 P1.2 P2.2
EXT_ADC: J1.1 P6.3
EXT_DAC: J3.1 P2.3 P4.3
IOVCC: P5.10 ; port DAC_COMMS.IOVCC
NCLR: P5.1 ; port DAC_COMMS.NCLR
NLDAC: P5.2 ; port DAC_COMMS.NLDAC
NRESET: P5.3 ; port DAC_COMMS.NRESET
NSYNC: P5.7 ; port DAC_COMMS.NSYNC
OUTD: P6.2 ; port ADC_OUT.ADC_OUT
PWR_5V_A: J4.1 ; port INAMP_PWR.PWR_5V_A
PWR_5V_D: J8.1 ; port DAC_PWR.PWR_5V_D
PWR_7V: J6.1 ; port ADC_PWR.PWR_7V
PWR_-2.5V: J6.3 ; port ADC_PWR.PWR_-2.5V
PWR_-5V_A: J4.3 ; port INAMP_PWR.PWR_-5V_A
PWR_-VBAT: J2.3 ; port BATT_PWR.PWR_-VBAT
PWR_VBAT: J2.1 ; port BATT_PWR.PWR_VBAT
SCLK: P5.4 ; port DAC_COMMS.SCLK
SDIN: P5.5 ; port DAC_COMMS.SDIN
SDO: P5.6 ; port DAC_COMMS.SDO
NetP6_1: P6.1 R54.2

### Notes on the sheet
- (near J1) ADC
- +VBAT/GND/-VBAT
- (near J3) DAC
- + 5V/GND/-5V
- (near J5) DUT
- WM5525-ND
- +7/-2.5V ADC
- +5V/GND DAC
- (near J7) DUT_VCG

### Library data of the parts
J1 J3 J5 J7 = CMP-2000-05487-1: SMA Right-Angle PCB Jack Receptacle, Brass Body, Gold Plated, 50 Ohm, 5-Pin THD, RoHS, Tray; Manufacturer: Molex; Datasheet Version: 09/2016; Package Description: 5-Pin Through Hole Device, Body 14.8 x 6.35 mm, Pitch 2.54 mm; Datasheet URL: http://www.molex.com/webdocs/datasheets/pdf/en-us/0731000114_RF_COAX_CONNECTORS.pdf; Manufacturer URL: http://www.molex.com/; Package Reference: 731000114; Mounting Technology: ThroughHole; Package URL: http://www.molex.com/pdm_docs/sd/731000114_sd.pdf; Supplier 1: Digi-Key; Supplier Part Number 1: WM5525-ND; Supplier Unit Price 1: 5.07000
J2 J4 J6 = CMP-1502-02466-1: Serie 2141 - 3.50 mm Horizontal Entry Modular with Rising Cage Clamp WR-TBL, 3 pin; Manufacturer: Wurth Elektronik; Pin Number: 3; Pitch: 3.50mm; Package Reference: 691214110003; Mounting Technology: THT; Part Number: 691214110003; Manufacturer URL: http://www.we-online.de; Packaging: Box; Operating Temperature: -40to105degC; Publisher: WurthElektronik; Datasheet URL: http://katalog.we-online.de/em/datasheet/6912141100xx.pdf
J8 = CMP-1502-02464-1: Serie 2141 - 3.50 mm Horizontal Entry Modular with Rising Cage Clamp WR-TBL, 2 pin; Manufacturer: Wurth Elektronik; Pin Number: 2; Pitch: 3.50mm; Datasheet URL: http://katalog.we-online.de/em/datasheet/6912141100xx.pdf; Packaging: Box; Mounting Technology: THT; Package Reference: 691214110002; Manufacturer URL: http://www.we-online.de; Part Number: 691214110002; Publisher: WurthElektronik; Operating Temperature: -40to105degC
P1 = CMP-2000-05243-1: Male Header, Pitch 2.54 mm, 1 x 4 Position, Height 11.7 mm, Tail Length 3.56 mm, RoHS, Bulk; Manufacturer: Molex; Voltage rating: 250V; Current rating: 4A; Datasheet Version: Rev. F, 06/2009; Operating temperature: 0degCto+75degC; Contact material: Tinplatedbrass; Manufacturer URL: http://www.molex.com/; Housing material: Nylon(UL94V-0); Datasheet URL: http://www.molex.com/pdm_docs/sd/022272041_sd.pdf; Supplier 1: Digi-Key; Supplier Part Number 1: WM4113-ND; Supplier Unit Price 1: 0.40000
P2 P4 P6 = CMP-1502-01062-1: THT Vertical Pin Header WR-PHD, Pitch 2.54 mm, Single Row, 3 pins; Manufacturer: Wurth Elektronik; Withstanding Voltage: 500VAC; Working Voltage: 250VAC; Rated Current: 3A; Pitch: 2.54mm; Pin Number: 3; Gender: Male; Contact Resistance: 20mOhm; Package Reference: 61300311121; Manufacturer URL: http://www.we-online.de; Datasheet URL: https://katalog.we-online.de/em/datasheet/6130xx11121.pdf; Operating Temperature: -40to105degC; Part Number: 61300311121; Orientation: Vertical; Packaging: Bag; Row Number: Single; Mounting Technology: THT; Publisher: WurthElektronik
P3 = CMP-1502-01064-1: THT Vertical Pin Header WR-PHD, Pitch 2.54 mm, Single Row, 4 pins; Manufacturer: Wurth Elektronik; Withstanding Voltage: 500VAC; Rated Current: 3A; Working Voltage: 250VAC; Pin Number: 4; Gender: Male; Contact Resistance: 20mOhm; Pitch: 2.54mm; Manufacturer URL: http://www.we-online.de; Operating Temperature: -40to105degC; Packaging: Bag; Mounting Technology: THT; Package Reference: 61300411121; Datasheet URL: https://katalog.we-online.de/em/datasheet/6130xx11121.pdf; Publisher: WurthElektronik; Part Number: 61300411121; Row Number: Single; Orientation: Vertical
P5 = CMP-2000-07330-1: Post Terminal Strip Assembly, Pitch 2.54 mm, 2 x 5 Position, Height 8.58 mm, Tail Length 2.54 mm, -55 to 125 degC, RoHS, Bulk; Manufacturer: Samtec-Inc.; Connector Type: Header,Unshrouded; Number of Positions Loaded: All; Pitch: 0.100"(2.54mm); Number of Positions: 10; Package Reference: TSW-105-07-G-D; Mounting Technology: ThroughHole; Datasheet URL: http://suddendocs.samtec.com/prints/tsw-xxx-xx-xxx-x-xx-xxx-mkt.pdf; Termination: Solder; Packaging: Bulk; Number of Rows: 2; Contact Finish: Gold; Mounting Type: ThroughHole; Features: -; Color: Black; Category: Connectors,Interconnects; Family: RectangularConnectors-Headers,MalePins; Manufacturer URL: http://www.samtec.com/; Series: TSW; Fastening Type: -; Package URL: http://suddendocs.samtec.com/prints/tsw-xxx-xx-x-x-xx-xxx-footprint.pdf; Row Spacing: 0.100"(2.54mm); Contact Mating Length: 0.230"(5.84mm); Contact Finish Thickness: 10µin(0.25µm); Contact Type: MalePin; Package Description: Male Header, Pitch 2.54 mm, 2 x 5 Position, Height 8.58 mm, Tail Length 2.54 mm; Datasheet Version: Rev. DO, 08/1988
P7 = CMP-1502-01060-1: THT Vertical Pin Header WR-PHD, Pitch 2.54 mm, Single Row, 2 pins; Manufacturer: Wurth Elektronik; Rated Current: 3A; Gender: Male; Withstanding Voltage: 500VAC; Working Voltage: 250VAC; Pitch: 2.54mm; Contact Resistance: 20mOhm; Pin Number: 2; Mounting Technology: THT; Orientation: Vertical; Operating Temperature: -40to105degC; Packaging: Bag; Publisher: WurthElektronik; Datasheet URL: https://katalog.we-online.de/em/datasheet/6130xx11121.pdf; Manufacturer URL: http://www.we-online.de; Row Number: Single; Package Reference: 61300211121; Part Number: 61300211121
R54 R55 = CMP-009-00023-4: do not place

## Sheet SPI_Relays.SchDoc
size A
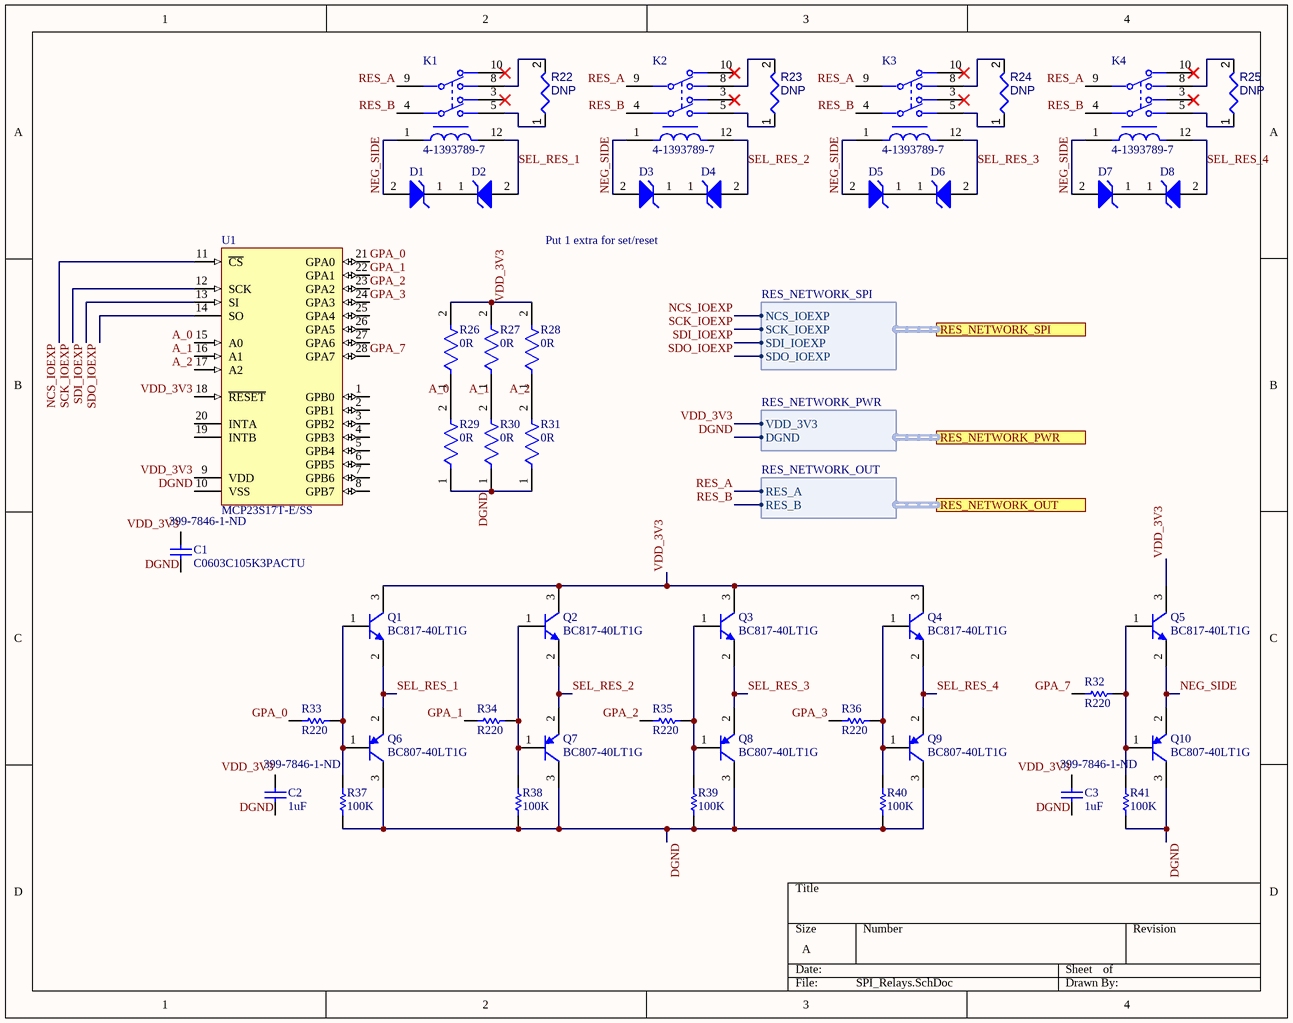
[diagram p6: SPI_Relays.SchDoc]

### Parts
C1  C0603C105K3PACTU  Supplier Part Number 1: 399-7846-1-ND  [CAPC1608X95X35LL15T15]
C2  1uF  Supplier Part Number 1: 399-7846-1-ND  [CAPC1608X95X35LL15T15]
C3  1uF  Supplier Part Number 1: 399-7846-1-ND  [CAPC1608X95X35LL15T15]
D1  SZMM3Z6V2T1G  [ONSC-SOD-323-2-477-02_V]  (value not drawn)
D2  SZMM3Z6V2T1G  [ONSC-SOD-323-2-477-02_V]  (value not drawn)
D3  SZMM3Z6V2T1G  [ONSC-SOD-323-2-477-02_V]  (value not drawn)
D4  SZMM3Z6V2T1G  [ONSC-SOD-323-2-477-02_V]  (value not drawn)
D5  SZMM3Z6V2T1G  [ONSC-SOD-323-2-477-02_V]  (value not drawn)
D6  SZMM3Z6V2T1G  [ONSC-SOD-323-2-477-02_V]  (value not drawn)
D7  SZMM3Z6V2T1G  [ONSC-SOD-323-2-477-02_V]  (value not drawn)
D8  SZMM3Z6V2T1G  [ONSC-SOD-323-2-477-02_V]  (value not drawn)
K1  4-1393789-7  [FP-4-1393789-7-MFG]
K2  4-1393789-7  [FP-4-1393789-7-MFG]
K3  4-1393789-7  [FP-4-1393789-7-MFG]
K4  4-1393789-7  [FP-4-1393789-7-MFG]
Q1  BC817-40LT1G  [ONSC-SOT-23-3-318-08_V]
Q2  BC817-40LT1G  [ONSC-SOT-23-3-318-08_V]
Q3  BC817-40LT1G  [ONSC-SOT-23-3-318-08_V]
Q4  BC817-40LT1G  [ONSC-SOT-23-3-318-08_V]
Q5  BC817-40LT1G  [ONSC-SOT-23-3-318-08_V]
Q6  BC807-40LT1G  [ONSC-SOT-23-3-318-08_V]
Q7  BC807-40LT1G  [ONSC-SOT-23-3-318-08_V]
Q8  BC807-40LT1G  [ONSC-SOT-23-3-318-08_V]
Q9  BC807-40LT1G  [ONSC-SOT-23-3-318-08_V]
Q10  BC807-40LT1G  [ONSC-SOT-23-3-318-08_V]
R22  DNP  [RESC1608X55X25ML10T15]
R23  DNP  [RESC1608X55X25ML10T15]
R24  DNP  [RESC1608X55X25ML10T15]
R25  DNP  [RESC1608X55X25ML10T15]
R26  0R  [FP-CR0603-MFG]
R27  0R  [FP-CR0603-MFG]
R28  0R  [FP-CR0603-MFG]
R29  0R  [FP-CR0603-MFG]
R30  0R  [FP-CR0603-MFG]
R31  0R  [FP-CR0603-MFG]
R32  R220  [RESC1609X50X30LL10T20]
R33  R220  [RESC1609X50X30LL10T20]
R34  R220  [RESC1609X50X30LL10T20]
R35  R220  [RESC1609X50X30LL10T20]
R36  R220  [RESC1609X50X30LL10T20]
R37  100K  [RESC1608X55X25ML10T15]
R38  100K  [RESC1608X55X25ML10T15]
R39  100K  [RESC1608X55X25ML10T15]
R40  100K  [RESC1608X55X25ML10T15]
R41  100K  [RESC1608X55X25ML10T15]
U1  MCP23S17T-E/SS  [SSOP-SS28_M]

### Ports
RES_NETWORK_OUT (harness RES_NETWORK_OUT), RES_NETWORK_PWR (harness RES_NETWORK_PWR), RES_NETWORK_SPI (harness RES_NETWORK_SPI)

### Harnesses
RES_NETWORK_SPI: NCS_IOEXP, SCK_IOEXP, SDI_IOEXP, SDO_IOEXP
RES_NETWORK_PWR: VDD_3V3, DGND
RES_NETWORK_OUT: RES_A, RES_B

### Nets
A_0: R26.1 R29.2 U1.15(A0)
A_1: R27.1 R30.2 U1.16(A1)
A_2: R28.1 R31.2 U1.17(A2)
DGND: C1.1 C2.1 C3.1 Q6.3(C) Q7.3(C) Q8.3(C) Q9.3(C) Q10.3(C) R29.1 R30.1 R31.1 R37.1 R38.1 R39.1 R40.1 R41.1 U1.10(VSS) ; port RES_NETWORK_PWR.DGND
GPA_0: R33.1 U1.21(GPA0)
GPA_1: R34.1 U1.22(GPA1)
GPA_2: R35.1 U1.23(GPA2)
GPA_3: R36.1 U1.24(GPA3)
GPA_7: R32.1 U1.28(GPA7)
NCS_IOEXP: U1.11(~{CS}) ; port RES_NETWORK_SPI.NCS_IOEXP
NEG_SIDE: D1.2(A) D3.2(A) D5.2(A) D7.2(A) K1.1 K2.1 K3.1 K4.1 Q5.2(E) Q10.2(E)
RES_A: K1.9 K2.9 K3.9 K4.9 ; port RES_NETWORK_OUT.RES_A  [project net +INA]
RES_B: K1.4 K2.4 K3.4 K4.4 ; port RES_NETWORK_OUT.RES_B  [project net +INB]
SCK_IOEXP: U1.12(SCK) ; port RES_NETWORK_SPI.SCK_IOEXP
SDI_IOEXP: U1.13(SI) ; port RES_NETWORK_SPI.SDI_IOEXP
SDO_IOEXP: U1.14(SO) ; port RES_NETWORK_SPI.SDO_IOEXP
SEL_RES_1: D2.2(A) K1.12 Q1.2(E) Q6.2(E)
SEL_RES_2: D4.2(A) K2.12 Q2.2(E) Q7.2(E)
SEL_RES_3: D6.2(A) K3.12 Q3.2(E) Q8.2(E)
SEL_RES_4: D8.2(A) K4.12 Q4.2(E) Q9.2(E)
VDD_3V3: C1.2 C2.2 C3.2 Q1.3(C) Q2.3(C) Q3.3(C) Q4.3(C) Q5.3(C) R26.2 R27.2 R28.2 U1.9(VDD) U1.18(~{RESET}) ; port RES_NETWORK_PWR.VDD_3V3
NetD1_1: D1.1(K) D2.1(K)
NetD3_1: D3.1(K) D4.1(K)
NetD5_1: D5.1(K) D6.1(K)
NetD7_1: D7.1(K) D8.1(K)
NetK1_5: K1.5 R22.1
NetK1_8: K1.8 R22.2
NetK2_5: K2.5 R23.1
NetK2_8: K2.8 R23.2
NetK3_5: K3.5 R24.1
NetK3_8: K3.8 R24.2
NetK4_5: K4.5 R25.1
NetK4_8: K4.8 R25.2
NetQ1_1: Q1.1(B) Q6.1(B) R33.2 R37.2
NetQ2_1: Q2.1(B) Q7.1(B) R34.2 R38.2
NetQ3_1: Q3.1(B) Q8.1(B) R35.2 R39.2
NetQ4_1: Q4.1(B) Q9.1(B) R36.2 R40.2
NetQ5_1: Q5.1(B) Q10.1(B) R32.2 R41.2

Not connected (* = marked no-connect by the designer): K1 3* 10*; K2 3* 10*; K3 3* 10*; K4 3* 10*; U1 1(GPB0) 2(GPB1) 3(GPB2) 4(GPB3) 5(GPB4) 6(GPB5) 7(GPB6) 8(GPB7) 19(INTB) 20(INTA) 25(GPA4) 26(GPA5) 27(GPA6)

### Notes on the sheet
- Put 1 extra for set/reset

### Library data of the parts
C1 = CMP-2006-02216-1: Manufacturer: Kemet; Description: KEMET - C0603C105K3PACTU - SMD Multilayer Ceramic Capacitor, 1 µF, 25 V, 0603 [1608 Metric], ± 10%, X5R, C Series KEMET; Dielectric Material: Ceramic; Capacitance: 1uF; Tolerance: 10%; Dielectric: X5R; Voltage Rating (DC): 25V; Part Number: C0603C105K3PACTU; Supplier 1: Digi-Key; Manufacturer Part Number: C0603C105K3PACTU; RoHS: Yes; Category: Ceramic Capacitors; Stock 1: 157618; Pricing 1: 1=0.18000, 10=0.12700, 50=0.07220, 100=0.05980, 500=0.04194, 1000=0.03472 (USD); Mount: Surface Mount; Case/Package: 0603; Contact Plating: Tin,Matte; Min Operating Temperature: -55°C; Max Operating Temperature: 85°C; Packaging: Tape and Reel; Voltage: 25V; Termination: SMD/SMT; Length: 1.6mm; Height: 0.8mm; Depth: 0.8mm; Radiation Hardening: No; Lead Free: Lead Free; ComponentLink1URL: https://datasheet.ciiva.com/28610/1918694-28610792.pdf?src-supplier=Element14; ComponentLink1Description: https://datasheet.ciiva.com/28610/1918694-28610792.pdf?src-supplier=Element14; ComponentLink2URL: https://datasheet.ciiva.com/5998/40889-5998745.pdf?src-supplier=Farnell; ComponentLink2Description: https://datasheet.ciiva.com/5998/40889-5998745.pdf?src-supplier=Farnell; Supplier Unit Price 1: 0.18
C2 C3 = CMP-2006-02216-1: as C16 on sheet ArduinoUnoShield; Supplier 1: Digi-Key; Manufacturer Part Number: C0603C105K3PACTU; RoHS: Yes; Category: Ceramic Capacitors; Stock 1: 157618; Pricing 1: 1=0.18000, 10=0.12700, 50=0.07220, 100=0.05980, 500=0.04194, 1000=0.03472 (USD); Mount: Surface Mount; Case/Package: 0603; Contact Plating: Tin,Matte; Min Operating Temperature: -55°C; Max Operating Temperature: 85°C; Capacitance: 1uF; Packaging: Tape and Reel; Voltage: 25V; Termination: SMD/SMT; Length: 1.6mm; Height: 0.8mm; Depth: 0.8mm; Radiation Hardening: No; Lead Free: Lead Free; ComponentLink1URL: https://datasheet.ciiva.com/28610/1918694-28610792.pdf?src-supplier=Element14; ComponentLink1Description: https://datasheet.ciiva.com/28610/1918694-28610792.pdf?src-supplier=Element14; ComponentLink2URL: https://datasheet.ciiva.com/5998/40889-5998745.pdf?src-supplier=Farnell; ComponentLink2Description: https://datasheet.ciiva.com/5998/40889-5998745.pdf?src-supplier=Farnell; Supplier Unit Price 1: 0.18
D1-D8 = CMP-1060-00701-1: Zener Voltage Regulator, 300 mW, 2-Pin SOD-323, Pb-Free, Tape and Reel; Manufacturer: On Semiconductor; VZ Typ (V): 6.2; P Max (W): 0.3; ComponentLink1Description: Manufacturer URL; Packing: Tape and Reel; PackageReference: SOD-323-2-477-02; PackageDescription: 2-Pin SOD, Body 1.7 x 1.25 mm; RoHS: Pb-Free; PackageVersion: Rev. H, 03/2007; ComponentLink1URL: http://www.onsemi.com/; ComponentLink2URL: http://www.onsemi.cn/pub_link/Collateral/MM3Z2V4T1-D.PDF; Mounting Technology: Surface Mount; DatasheetVersion: Rev. 9; PartNumber: SZMM3Z6V2T1G; ComponentLink2Description: Datasheet; ComponentLink3Description: Package Specification; ComponentLink3URL: http://www.onsemi.com/pub_link/Collateral/477-02.PDF.1
K1-K4 = CMP-03396-000019-1: RELAY GEN PURPOSE DPDT 2A 3VDC; Manufacturer: TE; Number Of Contacts: 2; Coil Type: Non-Latching; Switching Current: 5A; Coil Power: 200mW; Coil Resistance: 45Ω; Switching Power: 60W; Coil Voltage: 3V; Device Class L3: Signal Relays; Temperature: -40°C to +85°C; Height: 10.05mm; Ambient Temperature Range High: +85°C; Automotive: No; Category: Relay; Device Class L1: Electromechanical; Throw Configuration: DPDT; Digikey Description: RELAY GEN PURPOSE DPDT 2A 3VDC; Temperature Range Low: -40°C; RoHS: TRUE; Temperature Range High: +85°C; ComponentLink2Description: Datasheet; Lead Free: Yes; Current Rating: 2A; Device Class L2: Relays; ComponentLink2URL: https://www.te.com/usa-en/product-4-1393789-7.html?te_bu=Cor&te_type=other&te_campaign=oct_glo_cor-oct-global-oth-prtnr-fy19-oct-octo-buy-bom_sma-298_2&elqCampaignId=35216; Package: 4-1393789-7; Manufacturer Part Number: 4-1393789-7; Octopart: https://octopart.com/4-1393789-7-te+connectivity-40938501; Ambient Temperature Range Low: -40°C
Q1-Q5 = CMP-1048-00019-1: General Purpose Transistor, NPN Silicon, 3-Pin SOT-23, Pb-Free, Tape and Reel; Manufacturer: On Semiconductor; fT Min (MHz): 100; IC Continuous (A): 0.5; ComponentLink2URL: http://www.onsemi.com/pub_link/Collateral/BC817-16LT1-D.PDF; DatasheetVersion: Rev. 12; ComponentLink3URL: http://www.onsemi.cn/pub_link/Collateral/318-08.PDF; ComponentLink3Description: Package Specification; ComponentLink1Description: Manufacturer URL; Mounting Technology: Surface Mount; ComponentLink1URL: http://www.onsemi.com/; Packing: Tape and Reel; ComponentLink2Description: Datasheet; Polarity: NPN; RoHS: TRUE; PackageVersion: Rev. AP, 11/2009; PartNumber: BC817-40LT1G; PackageDescription: 3-Pin Small Outline Transistor, Body 2.92 x 1.3 mm, Pitch 0.95 mm; PackageReference: SOT-23-3-318-08
Q6-Q10 = CMP-1048-00745-1: General Purpose Transistor, PNP Silicon, 3-Pin SOT-23, Pb-Free, Tape and Reel; Manufacturer: On Semiconductor; fT Min (MHz): 100; IC Continuous (A): -0.5; Mounting Technology: Surface Mount; ComponentLink3URL: http://www.onsemi.cn/pub_link/Collateral/318-08.PDF; PartNumber: BC807-40LT1G; DatasheetVersion: Rev. 10; RoHS: TRUE; ComponentLink1URL: http://www.onsemi.com/; ComponentLink2URL: http://www.onsemi.com/pub_link/Collateral/BC807-16LT1-D.PDF; ComponentLink1Description: Manufacturer URL; ComponentLink3Description: Package Specification; PackageVersion: Rev. AP, 11/2009; PackageReference: SOT-23-3-318-08; PackageDescription: 3-Pin Small Outline Transistor, Body 2.92 x 1.3 mm, Pitch 0.95 mm; Packing: Tape and Reel; Polarity: PNP; ComponentLink2Description: Datasheet
R22-R25 = CMP-009-00023-4: do not place
R26-R31 = CMP-07231-000023-1: as R1 on sheet ArduinoUnoShield; Depth: 0.8mm; Height: 0.45mm; Case Code (Metric): 1608; Number of Pins: 2; Max Operating Temperature: 155°C; Mount: Surface Mount; REACH SVHC: No SVHC; Radiation Hardening: No; Width: 0.8mm; Max Power Dissipation: 100mW; Thickness: 457um; Package Quantity: 5000; Composition: Thick Film; Case/Package: 0603; Military Standard: Not; Packaging: Tape and Reel; Voltage Rating: 50V; Case Code (Imperial): 0603; Min Operating Temperature: -55°C; Contact Plating: Tin; Length: 1.6mm; Termination: SMD/SMT
R32-R36 = CMP-2000-03085-1: Part Number: CRCW0603220RFKEA; Manufacturer: Vishay Dale
R37-R41 = CMP-2100-03662-1: as R48 on sheet Power; Datasheet Version: Rev. 5, 10/2016; Height: 0.45mm; Lead Free: LeadFree; Manufacturer URL: http://www.yageo.com/; Package Reference: 0603; Depth: 0.8mm; RoHSCompliant: true; Composition: ThickFilm; Military Standard: Not; Resistance: 100KOhm; Case/Package: 0603; Packaging: TapeandReel; Case Code (Imperial): 0603; Voltage Rating (DC): 50V; Case Code (Metric): 1608; Tolerance: 1%; Termination: SMD/SMT; Min Operating Temperature: -55degC; Number of Pins: 2; Length: 1.6mm; Width: 0.8mm; Datasheet URL: http://www.yageo.com/NewPortal/yageodocoutput?fileName=/pdf/R-Chip/PYu-RC_Group_51_RoHS_L_5.pdf; Package Description: 2-Pin Surface Mount Device, Body 1.6 x 0.8 mm; Max Operating Temperature: 155degC; REACH SVHC: NoSVHC
U1 = CMP-0186-00173-2: 16-Bit I/O Expander with Serial Interface, 28-Pin SSOP, Extended Temperature, Tape and Reel; RevisionNote: URLs added. Sch pin type corrected.; PackageVersion: revBB, Aug-2009; DatasheetVersion: revB, Feb-2007; ComponentLink3Description: Package Specification; PackageDescription: 28-Lead Plastic Shrink Small Outline (SS) - 5.3mm Body [SSOP]; ComponentLink2Description: Datasheet; ComponentLink2URL: http://ww1.microchip.com/downloads/en/DeviceDoc/21952b.pdf; PackageReference: SSOP-SS28; ComponentLink1Description: Manufacturer URL; ComponentLink3URL: http://www.microchip.com/stellent/groups/techpub_sg/documents/packagingspec/en012702.pdf; ComponentLink1URL: http://www.microchip.com/; Code_JEDEC: MS-150

## Nets that join several sheets
+INA: In_Amp (A1.3 A1.9 U5.4), SPI_Relays (K1.9 K2.9 K3.9 K4.9)
+INB: In_Amp (A1.5 R53.2), SPI_Relays (K1.4 K2.4 K3.4 K4.4)
+INC: In_Amp (A1.10), Connectors (P4.2)
A5: ArduinoUnoShield (AD1.6), Connectors (R54.1 R55.2)
ADC_CNV: ArduinoUnoShield (R20.1), Connectors (P3.4)
ADC_SCK: ArduinoUnoShield (R16.1), Connectors (P3.2)
ADC_SDI: ArduinoUnoShield (R14.1), Connectors (P3.1)
ADC_SDO: ArduinoUnoShield (R18.1), Connectors (P3.3)
AGND: Power (16 pins), In_Amp (R52.1 RN1.9 RN2.5 RN2.9), Connectors (22 pins)
D2: ArduinoUnoShield (IOL1.3), In_Amp (U5.6)
D7: ArduinoUnoShield (IOL1.8), Connectors (P2.1 P4.1)
DGND: ArduinoUnoShield (7 pins), Power (R47.1), In_Amp (U5.2), Connectors (J8.2 P5.8 P5.9), SPI_Relays (17 pins)
DUT: In_Amp (U5.3), Connectors (J5.1 P1.1)
IOVCC: ArduinoUnoShield (R13.1), Connectors (P5.10)
NCS_IOEXP: ArduinoUnoShield (R10.1), SPI_Relays (U1.11)
NSYNC: ArduinoUnoShield (R19.1), Connectors (P5.7)
OUTD: In_Amp (A1.14 RN2.8), Connectors (P6.2)
PWR_5V_A: Power (C5.2 C6.2 R42.1 U2.10), In_Amp (A1.4 C17.2), Connectors (J4.1)
PWR_5V_D: ArduinoUnoShield (POWER1.4), Connectors (J8.1)
PWR_7V: Power (C14.2 C15.2 R48.2 U4.5), Connectors (J6.1)
PWR_-2.5V: Power (C12.2 U3.5), Connectors (J6.3)
PWR_-5V_A: Power (C8.2 C9.2 R43.2 U2.6), In_Amp (A1.11 C17.1), Connectors (J4.3)
PWR_-VBAT: Power (5 pins), Connectors (J2.3)
PWR_VBAT: ArduinoUnoShield (POWER1.1), Power (6 pins), Connectors (J2.1)
SCK_IOEXP: ArduinoUnoShield (R11.1), SPI_Relays (U1.12)
SCLK: ArduinoUnoShield (R21.1), Connectors (P5.4)
SD_CD: ArduinoUnoShield (R7.2), SD_Card (SD1.9)
SD_CS: ArduinoUnoShield (R1.2), SD_Card (SD1.2)
SD_DI: ArduinoUnoShield (R2.2), SD_Card (SD1.3)
SD_DO: ArduinoUnoShield (R6.2), SD_Card (SD1.7)
SD_SCLK: ArduinoUnoShield (R4.2), SD_Card (SD1.5)
SD_VDD: ArduinoUnoShield (R3.2), SD_Card (SD1.4)
SD_VSS: ArduinoUnoShield (R5.2), SD_Card (5 pins)
SDI_IOEXP: ArduinoUnoShield (R8.1), SPI_Relays (U1.13)
SDIN: ArduinoUnoShield (R15.1), Connectors (P5.5)
SDO: ArduinoUnoShield (R17.1), Connectors (P5.6)
SDO_IOEXP: ArduinoUnoShield (R9.1), SPI_Relays (U1.14)
VDD_3V3: ArduinoUnoShield (C16.2 F1.1 R3.1 R13.2), In_Amp (U5.5), SPI_Relays (13 pins)